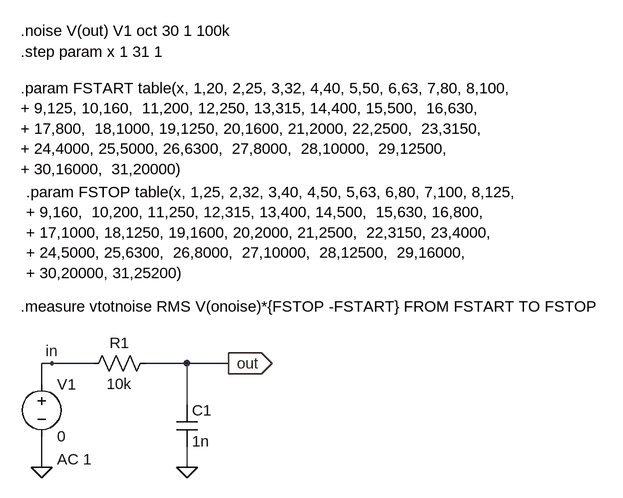
[diagram p0: schematic rc_total_noise_sweep 3B.asc]
rc_total_noise_sweep 3B.asc, the LTspice schematic file:
Version 4
SHEET 1 5060 680
WIRE 16 -176 0 -176
WIRE 80 -176 16 -176
WIRE 224 -176 160 -176
WIRE 288 -176 224 -176
WIRE 0 -144 0 -176
WIRE 224 -112 224 -176
WIRE 0 -16 0 -64
WIRE 224 -16 224 -48
FLAG 0 -16 0
FLAG 224 -16 0
FLAG 288 -176 out
IOPIN 288 -176 Out
FLAG 16 -176 in
SYMBOL res 64 -160 R270
WINDOW 0 32 56 VTop 0
WINDOW 3 0 56 VBottom 0
SYMATTR InstName R1
SYMATTR Value 10k
SYMBOL cap 208 -112 R0
SYMATTR InstName C1
SYMATTR Value 1n
SYMBOL voltage 0 -160 R0
WINDOW 123 24 132 Left 0
WINDOW 39 0 0 Left 0
SYMATTR Value2 AC 1
SYMATTR InstName V1
SYMATTR Value 0
TEXT -32 -264 Left 0 !.measure vtotnoise RMS V(onoise)*{FSTOP -FSTART} FROM FSTART TO FSTOP
TEXT -32 -688 Left 0 !.noise V(out) V1 oct 30 1 100k
TEXT -32 -600 Left 0 !.param FSTART table(x, 1,20, 2,25, 3,32, 4,40, 5,50, 6,63, 7,80, 8,100, \n+ 9,125, 10,160,  11,200, 12,250, 13,315, 14,400, 15,500,  16,630, \n+ 17,800,  18,1000, 19,1250, 20,1600, 21,2000, 22,2500,  23,3150, \n+ 24,4000, 25,5000, 26,6300,  27,8000,  28,10000,  29,12500,  \n+ 30,16000,  31,20000)
TEXT -24 -440 Left 0 !.param FSTOP table(x, 1,25, 2,32, 3,40, 4,50, 5,63, 6,80, 7,100, 8,125, \n+ 9,160,  10,200, 11,250, 12,315, 13,400, 14,500,  15,630, 16,800,  \n+ 17,1000, 18,1250, 19,1600, 20,2000, 21,2500,  22,3150, 23,4000, \n+ 24,5000, 25,6300,  26,8000,  27,10000,  28,12500,  29,16000, \n+ 30,20000, 31,25200)
TEXT -32 -656 Left 0 !.step param x 1 31 1

The netlist it stands for:
* rc_total_noise_sweep 3B.asc
R1 in out 10k
C1 out 0 1n
V1 in 0 0 AC 1
.measure vtotnoise RMS V(onoise)*{FSTOP -FSTART} FROM FSTART TO FSTOP
.noise V(out) V1 oct 30 1 100k
.param FSTART table(x, 1,20, 2,25, 3,32, 4,40, 5,50, 6,63, 7,80, 8,100,
+ 9,125, 10,160,  11,200, 12,250, 13,315, 14,400, 15,500,  16,630,
+ 17,800,  18,1000, 19,1250, 20,1600, 21,2000, 22,2500,  23,3150,
+ 24,4000, 25,5000, 26,6300,  27,8000,  28,10000,  29,12500,
+ 30,16000,  31,20000)
.param FSTOP table(x, 1,25, 2,32, 3,40, 4,50, 5,63, 6,80, 7,100, 8,125,
+ 9,160,  10,200, 11,250, 12,315, 13,400, 14,500,  15,630, 16,800,
+ 17,1000, 18,1250, 19,1600, 20,2000, 21,2500,  22,3150, 23,4000,
+ 24,5000, 25,6300,  26,8000,  27,10000,  28,12500,  29,16000,
+ 30,20000, 31,25200)
.step param x 1 31 1
.backanno
.end